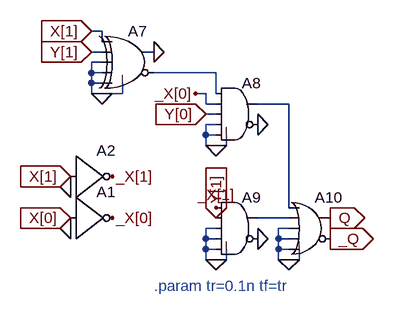
[diagram p0: schematic lt-2bit.asc]
lt-2bit.asc, the LTspice schematic file:
Version 4
SHEET 1 880 680
WIRE 336 208 320 208
WIRE 336 224 336 208
WIRE 336 240 320 240
WIRE 416 240 400 240
WIRE 336 256 320 256
WIRE 320 272 320 256
WIRE 336 272 320 272
WIRE 512 272 416 272
WIRE 320 288 320 272
WIRE 336 288 320 288
WIRE 320 304 320 288
WIRE 336 304 320 304
WIRE 368 304 368 288
WIRE 368 304 336 304
WIRE 496 304 480 304
WIRE 512 304 512 272
WIRE 496 320 496 304
WIRE 512 320 496 320
WIRE 624 320 576 320
WIRE 512 336 496 336
WIRE 512 352 496 352
WIRE 496 368 496 352
WIRE 512 368 496 368
WIRE 496 384 496 368
WIRE 512 384 496 384
WIRE 528 384 528 368
WIRE 528 384 512 384
WIRE 624 480 624 320
WIRE 624 496 576 496
WIRE 512 512 496 512
WIRE 624 512 608 512
WIRE 496 528 496 512
WIRE 512 528 496 528
WIRE 608 528 608 512
WIRE 624 528 608 528
WIRE 496 544 496 528
WIRE 512 544 496 544
WIRE 608 544 608 528
WIRE 624 544 608 544
WIRE 496 560 496 544
WIRE 512 560 496 560
WIRE 528 560 528 544
WIRE 528 560 512 560
WIRE 608 560 608 544
WIRE 624 560 608 560
WIRE 640 560 640 544
WIRE 640 560 624 560
FLAG 288 448 0
FLAG 288 432 X[1]
IOPIN 288 432 In
FLAG 352 432 _X[1]
FLAG 480 304 _X[0]
FLAG 496 336 Y[0]
IOPIN 496 336 In
FLAG 288 512 0
FLAG 288 496 X[0]
IOPIN 288 496 In
FLAG 352 496 _X[0]
FLAG 320 240 Y[1]
IOPIN 320 240 In
FLAG 320 208 X[1]
IOPIN 320 208 In
FLAG 336 304 0
FLAG 512 384 0
FLAG 576 352 0
FLAG 416 240 0
FLAG 512 560 0
FLAG 576 528 0
FLAG 512 496 Y[1]
IOPIN 512 496 In
FLAG 512 480 _X[1]
FLAG 624 560 0
FLAG 688 496 Q
IOPIN 688 496 Out
FLAG 688 528 _Q
IOPIN 688 528 Out
SYMBOL Digital\\inv 288 368 R0
SYMATTR InstName A2
SYMBOL Digital\\and 544 272 R0
SYMATTR InstName A8
SYMBOL Digital\\and 544 448 R0
SYMATTR InstName A9
SYMBOL Digital\\or 656 448 R0
SYMATTR InstName A10
SYMBOL Digital\\xor 384 192 R0
SYMATTR InstName A7
SYMBOL Digital\\inv 288 432 R0
SYMATTR InstName A1
TEXT 416 600 Left 2 ;.param tr=0.1n tf=tr

The netlist it stands for:
* lt-2bit.asc
A2 X[1] 0 0 0 0 _X[1] 0 0 BUF
A8 N001 _X[0] Y[0] 0 0 0 N002 0 AND
A9 _X[1] Y[1] 0 0 0 0 N003 0 AND
A10 N002 N003 0 0 0 _Q Q 0 OR
A7 X[1] Y[1] 0 0 0 N001 0 0 XOR
A1 X[0] 0 0 0 0 _X[0] 0 0 BUF
* .param tr=0.1n tf=tr
.backanno
.end